# Altium schematic sheet electronic.SchDoc
size A4
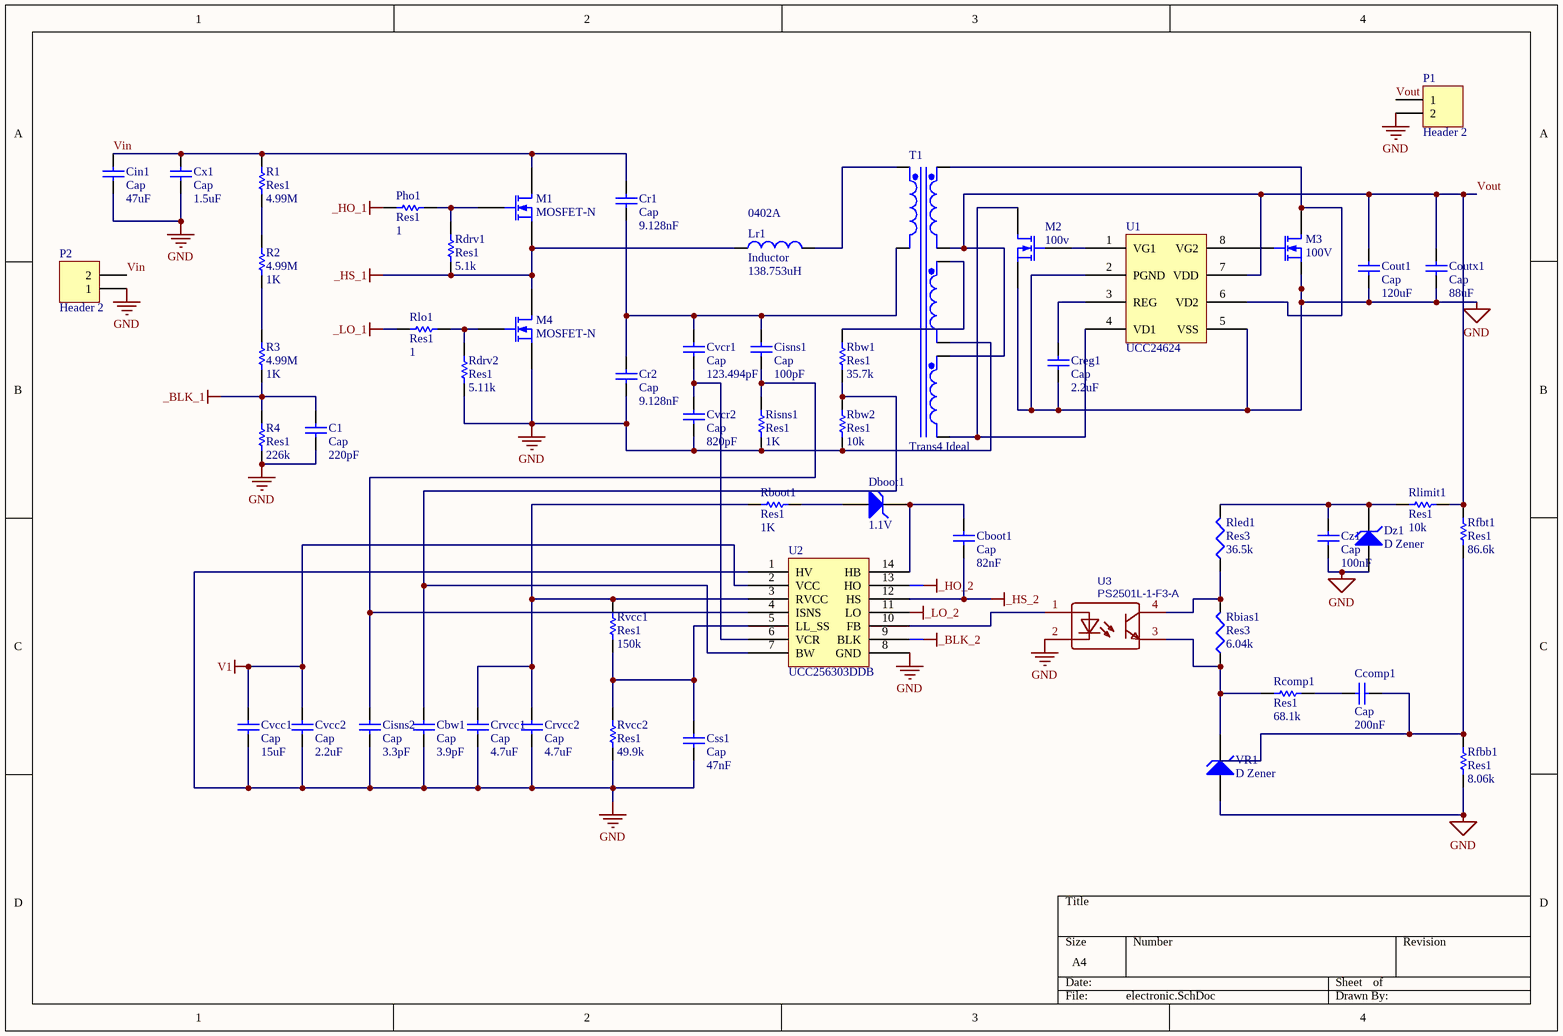
[diagram p0: electronic.SchDoc]

## Parts
C1  Cap  value 220pF  [C0805]
Cboot1  Cap  value 82nF  [C0805]
Cbw1  Cap  value 3.9pF  [C0805]
Ccomp1  Cap  value 200nF  [C0805]
Cin1  Cap  value 47uF  [C0805]
Cisns1  Cap  value 100pF  [C0805]
Cisns2  Cap  value 3.3pF  [C0805]
Cout1  Cap  value 120uF  [C0805]
Coutx1  Cap  value 88uF  [C0805]
Cr1  Cap  value 9.128nF  [C0805]
Cr2  Cap  value 9.128nF  [C0805]
Creg1  Cap  value 2.2uF  [C0805]
Crvcc1  Cap  value 4.7uF  [C0805]
Crvcc2  Cap  value 4.7uF  [C0805]
Css1  Cap  value 47nF  [C0805]
Cvcc1  Cap  value 15uF  [C0805]
Cvcc2  Cap  value 2.2uF  [C0805]
Cvcr1  Cap  value 123.494pF  [C0805]
Cvcr2  Cap  value 820pF  [C0805]
Cx1  Cap  value 1.5uF  [C0805]
Cz1  Cap  value 100nF  [C0805]
Dboot1  1.1V  [ST1300A - duplicate]
Dz1  D Zener  [BZX84C11LT1G]
Lr1  Inductor  value 138.753uH  [0402-A]
M1  MOSFET-N  [FQDN30TM]
M2  100v  [CSD19538Q3A]
M3  100V  [CSD19538Q3A]
M4  MOSFET-N  [FQDN30TM]
P1  Header 2  [HDR1X2]
P2  Header 2  [HDR1X2]
Pho1  Res1  value 1  [R 0805_M]
R1  Res1  value 4.99M  [R 0805_M]
R2  4.99M  value 1K  [R 0805_M]
R3  4.99M  value 1K  [R 0805_M]
R4  Res1  value 226k  [R 0805_M]
Rbias1  Res3  value 6.04k  [R 0805_M]
Rboot1  Res1  value 1K  [R 0805_M]
Rbw1  Res1  value 35.7k  [R 0805_M]
Rbw2  Res1  value 10k  [R 0805_M]
Rcomp1  Res1  value 68.1k  [R 0805_M]
Rdrv1  Res1  value 5.1k  [R 0805_M]
Rdrv2  Res1  value 5.11k  [R 0805_M]
Rfbb1  Res1  value 8.06k  [R 0805_M]
Rfbt1  Res1  value 86.6k  [AXIAL-0.3]
Risns1  Res1  value 1K  [R 1206]
Rled1  Res3  value 36.5k  [R 0805_M]
Rlimit1  Res1  value 10k  [R 0805_M]
Rlo1  Res1  value 1  [R 0805_M]
Rvcc1  Res1  value 150k  [R 0805_M]
Rvcc2  Res1  value 49.9k  [R 0805_M]
T1  Trans4 Ideal  [TRF_8]
U1  UCC24624  [UCC24624]
U2  UCC256303DDB  [UCC256303]
U3  PS2501L-1-F3-A  [PS2501-S]
VR1  D Zener  [TLV431x]

## Nets
_BLK_1: C1.2 R3.1 R4.2
_BLK_2: U2.9(BLK)
_HO_1: Pho1.1
_HO_2: U2.13(HO)
_HS_1: Lr1.1 M1.3(S) M4.1(D) Rdrv1.1
_HS_2: Cboot1.1 U2.12(HS)
_LO_1: Rlo1.1
_LO_2: U2.11(LO)
GND: C1.1 Cbw1.1 Cin1.1 Cisns2.1 Cout1.2 Coutx1.2 Cr2.1 Creg1.1 Crvcc1.1 Crvcc2.1 Css1.2 Cvcc1.1 Cvcc2.1 Cvcr2.1 Cx1.1 Cz1.1 Dz1.1(A) M2.3(S) M3.3(S) M4.3(S) P1.2 P2.1 R4.1 Rbw2.1 Rdrv2.1 Rfbb1.1 Risns1.1 Rvcc2.1 T1.6(Sec2-) U1.2(PGND) U1.5(VSS) U2.1(HV) U2.8(GND) U3.2(CAT) VR1.1(A)
V1: Cvcc1.2 Cvcc2.2 U2.2(VCC)
Vin: Cin1.2 Cr1.2 Cx1.2 M1.1(D) P2.2 R1.2
Vout: Cout1.1 Coutx1.1 P1.1 Rfbt1.2 Rlimit1.2 T1.4(Sec1-) T1.7(Sec3+) U1.7(VDD)
NetCboot1_2: Cboot1.2 Dboot1.2(K) U2.14(HB)
NetCbw1_2: Cbw1.2 Rbw1.1 Rbw2.2 U2.7(BW)
NetCcomp1_1: Ccomp1.1 Rcomp1.2
NetCcomp1_2: Ccomp1.2 Rfbb1.2 Rfbt1.1
NetCisns1_1: Cisns1.1 Cisns2.2 Risns1.2 U2.4(ISNS)
NetCisns1_2: Cisns1.2 Cr1.1 Cr2.2 Cvcr1.2 T1.2(Pri-)
NetCreg1_2: Creg1.2 U1.3(REG)
NetCrvcc1_2: Crvcc1.2 Crvcc2.2 Rboot1.1 Rvcc1.2 U2.3(RVCC)
NetCss1_1: Css1.1 Rvcc1.1 Rvcc2.2 U2.5(LL_SS)
NetCvcr1_1: Cvcr1.1 Cvcr2.2 U2.6(VCR)
NetCz1_2: Cz1.2 Dz1.2(K) Rled1.2 Rlimit1.1
NetDboot1_1: Dboot1.1(A) Rboot1.2
NetLr1_2: Lr1.2 T1.1(Pri+)
NetM1_2: M1.2(G) Pho1.2 Rdrv1.2
NetM2_1: M2.1(D) T1.8(Sec3-) U1.4(VD1)
NetM2_2: M2.2(G) U1.1(VG1)
NetM3_1: M3.1(D) T1.3(Sec1+) U1.6(VD2)
NetM3_2: M3.2(G) U1.8(VG2)
NetM4_2: M4.2(G) Rdrv2.2 Rlo1.2
NetR1_1: R1.1 R2.2
NetR2_1: R2.1 R3.2
NetRbias1_1: Rbias1.1 Rcomp1.1 U3.3(EM) VR1.2(K)
NetRbias1_2: Rbias1.2 Rled1.1 U3.4(COL)
NetRbw1_2: Rbw1.2 T1.5(Sec2+)
NetU2_10: U2.10(FB) U3.1(AN)

## Notes on the sheet
- (near Lr1) 0402A

## Library data of the parts
C1 Cboot1 Cbw1 Ccomp1 Cin1 Cisns1 Cisns2 Cout1 Coutx1 Cr1 Cr2 Creg1 Crvcc1 Crvcc2 Css1 Cvcc1 Cvcc2 Cvcr1 Cvcr2 Cx1 Cz1 = Cap: Capacitor; Published: 8-Jun-2000; LatestRevisionDate: 17-Jul-2002; LatestRevisionNote: Re-released for DXP Platform.; PackageReference: RAD-0.3; Publisher: Altium Limited; PackageDescription: Radial Cap, Thru-Hole; 2 Leads; 0.3 in Pin Spacing
Dboot1 Dz1 VR1 = D Zener: Zener Diode; Published: 8-Jun-2000; LatestRevisionDate: 17-Jul-2002; LatestRevisionNote: Re-released for DXP Platform.; PackageReference: DIODE-0.7; Publisher: Altium Limited; PackageDescription: Diode, Thru-Hole; 2 Leads; 0.7 in Pin Spacing
Lr1 = Inductor: Code_IEC: 1005; Published: 8-Jun-2000; LatestRevisionDate: 29-May-2009; LatestRevisionNote: IPC-7351 Footprint Added.; PackageReference: 0402-A; Publisher: Altium Limited; PackageDescription: Chip Inductor; Code_JEITA: 0402
M1-M4 = MOSFET-N: N-Channel MOSFET; Published: 8-Jun-2000; LatestRevisionDate: 17-Jul-2002; LatestRevisionNote: Re-released for DXP Platform.; PackageVersion: 1995/1996; PackageReference: E3; Publisher: Altium Limited; PackageDescription: TO, Flat Index; 3 In-Line, Axial Leads; Body Dia. 4.6mm; Lead Dia. 0.5 mm (max)
P1 P2 = Header 2: Header, 2-Pin; LatestRevisionDate: 17-Jul-2002; LatestRevisionNote: Re-released for DXP Platform.; Publisher: Altium Limited
Pho1 R1-R4 Rboot1 Rbw1 Rbw2 Rcomp1 Rdrv1 Rdrv2 Rfbb1 Rfbt1 Risns1 Rlimit1 Rlo1 Rvcc1 Rvcc2 = Res1: Resistor; Published: 8-Jun-2000; LatestRevisionDate: 17-Jul-2002; LatestRevisionNote: Re-released for DXP Platform.; PackageReference: AXIAL-0.3; Publisher: Altium Limited; PackageDescription: Axial Device, Thru-Hole; 2 Leads; 0.3 in Pin Spacing
Rbias1 Rled1 = Res3: Resistor; Published: 8-Jun-2000; LatestRevisionDate: 29-May-2009; LatestRevisionNote: IPC-7351 Footprint Added.; PackageReference: J1-0603; Publisher: Altium Limited; PackageDescription: Chip Resistor
T1 = Trans4 Ideal: Four-winding Transformer (Ideal); Published: 25-Jan-2001; LatestRevisionDate: 17-Jul-2002; LatestRevisionNote: Re-released for DXP Platform.; PackageReference: TRF_8; Publisher: Altium Limited; PackageDescription: Transformer; 8 Leads
U3 = PS2501L-1-F3-A: BOM_Manufacturer: RENESAS; BOM_Supplier: LCSC; BOM_Manufacturer Part: PS2501L-1-F3-A; BOM_Supplier Part: C51825; BOM_JLCPCB Part Class: Extended Part; spicePre: U; spiceSymbolName: PS2501L-1-F3-A